# EAGLE design remote_connector (EAGLE 5.07)
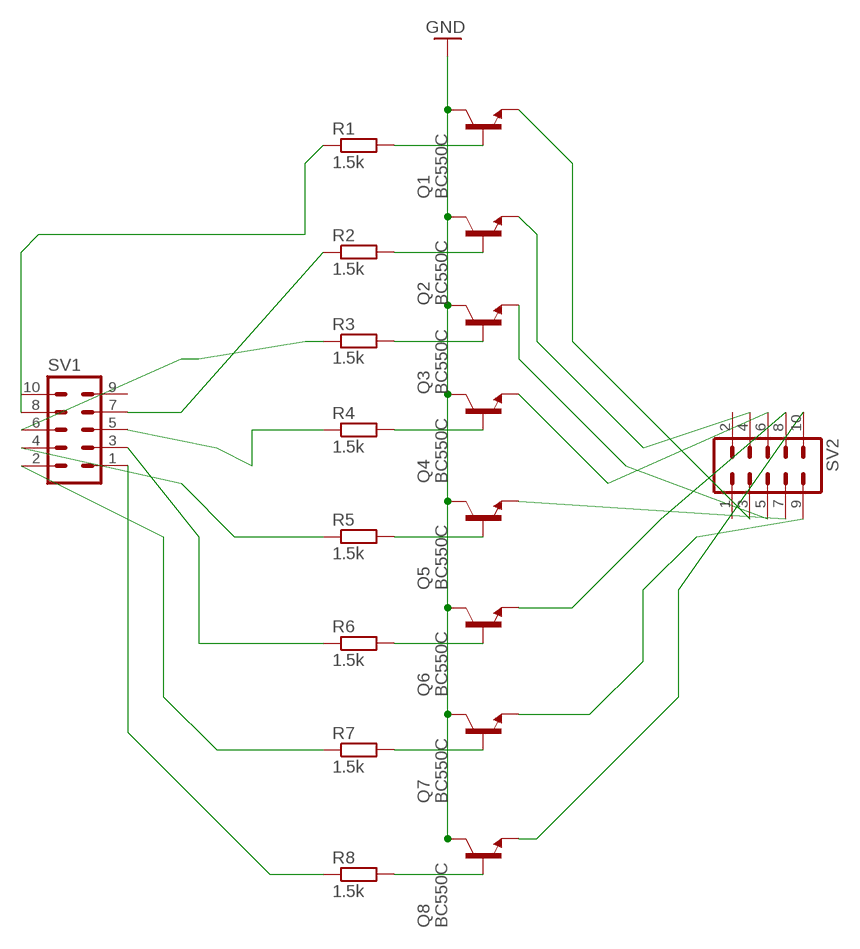
[diagram p0: schematic, sheet 1]

## Parts
Q1  BC550C  [TO92-EBC]
Q2  BC550C  [TO92-EBC]
Q3  BC550C  [TO92-EBC]
Q4  BC550C  [TO92-EBC]
Q5  BC550C  [TO92-EBC]
Q6  BC550C  [TO92-EBC]
Q7  BC550C  [TO92-EBC]
Q8  BC550C  [TO92-EBC]
R1  1.5k  R-EU_0204/7  [0204/7]
R2  1.5k  R-EU_0204/7  [0204/7]
R3  1.5k  R-EU_0204/7  [0204/7]
R4  1.5k  R-EU_0204/7  [0204/7]
R5  1.5k  R-EU_0204/7  [0204/7]
R6  1.5k  R-EU_0204/7  [0204/7]
R7  1.5k  R-EU_0204/7  [0204/7]
R8  1.5k  R-EU_0204/7  [0204/7]
SV1  MA05-2  [MA05-2]
SV2  MA05-2  [MA05-2]

## Nets
GND [gnd]: Q1.C Q2.C Q3.C Q4.C Q5.C Q6.C Q7.C Q8.C
N$1: R8.1 SV1.1
N$2: Q8.B R8.2
N$3: Q7.B R7.2
N$4: Q6.B R6.2
N$5: Q5.B R5.2
N$6: Q4.B R4.2
N$7: Q3.B R3.2
N$8: Q2.B R2.2
N$9: Q1.B R1.2
N$10: R7.1 SV1.2
N$11: R6.1 SV1.3
N$12: R5.1 SV1.4
N$13: R4.1 SV1.5
N$14: R3.1 SV1.6
N$15: R2.1 SV1.7
N$16: R1.1 SV1.8
N$17: Q8.E SV2.10
N$18: Q7.E SV2.9
N$19: Q6.E SV2.8
N$20: Q5.E SV2.7
N$21: Q4.E SV2.6
N$22: Q3.E SV2.5
N$23: Q2.E SV2.4
N$24: Q1.E SV2.3
Unconnected: SV1.9 SV1.10 SV2.1 SV2.2

## Library data of the parts
Q1-Q8 = transistor-npn:BC550*: NPN Transistor
R1-R8 = rcl:R-EU_: RESISTOR, European symbol
SV1 SV2 = con-lstb:MA05-2: PIN HEADER

## Board
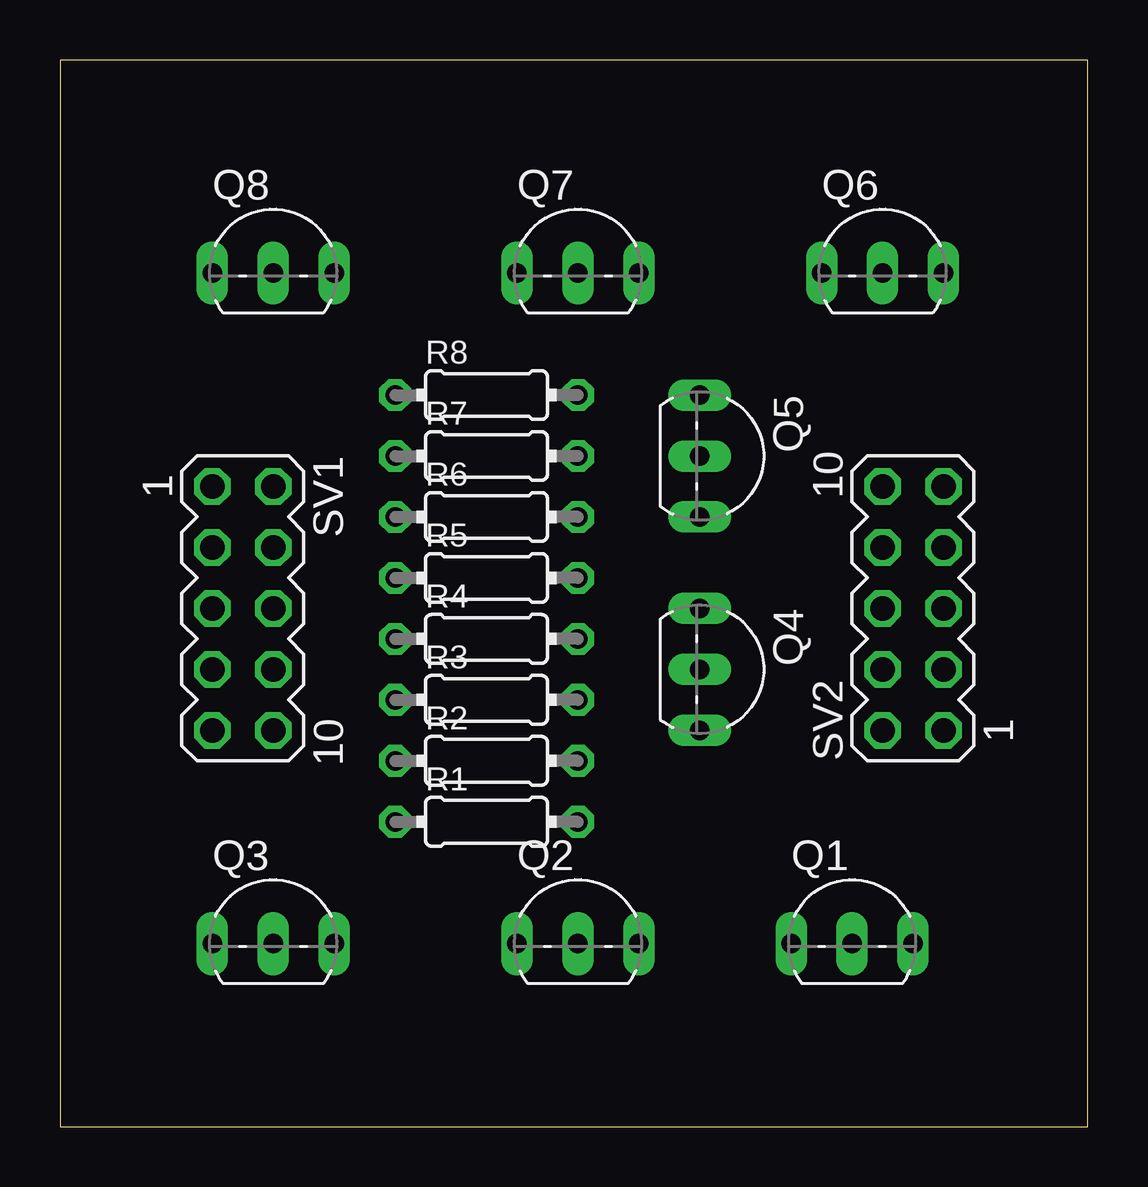
[diagram p1: board, top side]
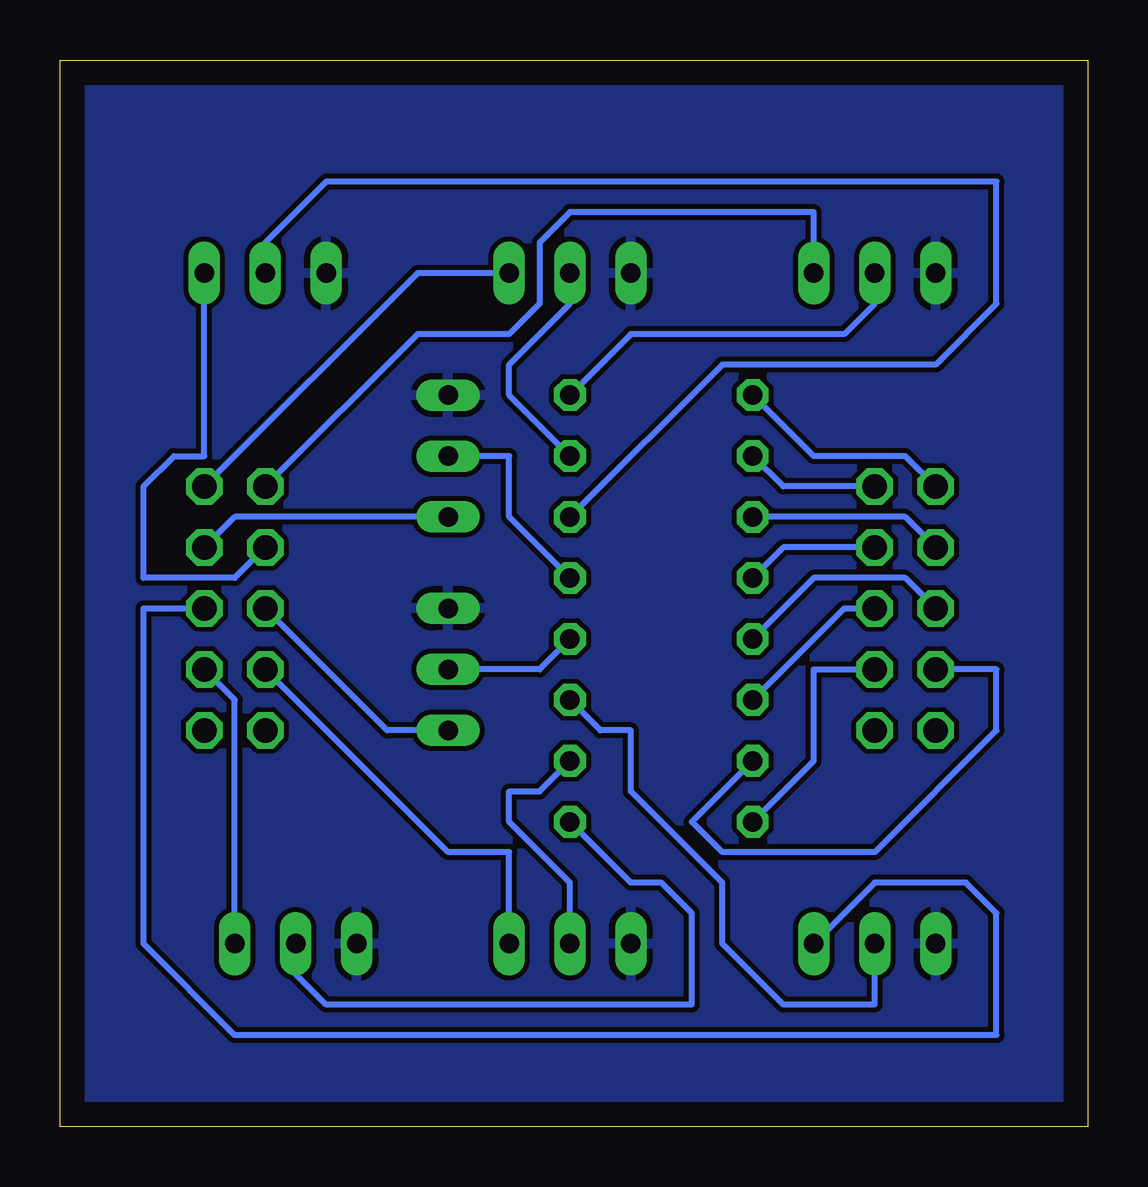
[diagram p2: board, bottom side, seen from below]

Size 42.85 x 44.44 mm. Coordinates in mm from the lower left corner, seen from the top.
Outline: 0,0 42.85,0 42.85,44.44 0,44.44 0,0
Copper layers (1*16): Top 0.035mm / dielectric 1.5mm / Bottom 0.035mm
Design rules "default": minimum track width 10mil, minimum drill 24mil, track to track 8mil, track to pad 8mil, pad to pad 8mil, via to via 8mil, smd to smd 8mil, copper to edge 40mil, drill to drill 8mil, minimum pad ring 10mil, minimum via ring 8mil, stop-mask expansion 4mil, vias tented up to drill 0mil, thermal gap 10mil

### Footprints (pad centres in the part's own frame; a part is rotated, then mirrored left to right if it is on the bottom)
TO92-EBC = drill 0.813 long: B 0,-1.27; C -2.54,-1.27; E 2.54,-1.27
0204/7 = drill 0.813 octagon: 1 -3.81,0; 2 3.81,0
MA05-2 = drill 1.016 octagon: 1 -5.08,-1.27; 2 -5.08,1.27; 3 -2.54,-1.27; 4 -2.54,1.27; 5 0,-1.27; 6 0,1.27; 7 2.54,-1.27; 8 2.54,1.27; 9 5.08,-1.27; 10 5.08,1.27

### Placement (x,y rotation side)
Q1  33.02,8.89 0 top
Q2  21.59,8.89 0 top
Q3  8.89,8.89 0 top
Q4  27.94,19.05 270 top
Q5  27.94,27.94 270 top
Q6  34.29,36.83 0 top
Q7  21.59,36.83 0 top
Q8  8.89,36.83 0 top
R1  17.78,12.7 0 top
R2  17.78,15.24 0 top
R3  17.78,17.78 0 top
R4  17.78,20.32 0 top
R5  17.78,22.86 0 top
R6  17.78,25.4 0 top
R7  17.78,27.94 0 top
R8  17.78,30.48 0 top
SV1  7.62,21.59 270 top
SV2  35.56,21.59 90 top

### Tracks (layer width: path | path; a pad name or v marks a point on that pad's centre or on a via)
GND
  pour Bottom: 0,0 43.18,0 43.18,44.45 0,44.45
N$1
  Bottom 0.254: R8.1 11.43,27.94 7.62,27.94 SV1.1
N$2
  Bottom 0.254: R8.2 19.05,33.02 10.16,33.02 8.89,34.29 Q8.B
N$3
  Bottom 0.254: R7.2 24.13,30.48 24.13,31.75 21.59,34.29 Q7.B
N$4
  Bottom 0.254: R6.2 15.24,31.75 6.35,31.75 3.81,34.29 3.81,39.37 31.75,39.37 34.29,36.83 Q6.B
N$5
  Bottom 0.254: R5.2 24.13,25.4 24.13,27.94 Q5.B
N$6
  Bottom 0.254: Q4.B 22.86,19.05 R4.2
N$7
  Bottom 0.254: Q3.B 8.89,5.08 12.7,5.08 15.24,7.62 15.24,10.16 19.05,13.97 19.05,16.51 20.32,16.51 R3.2
N$8
  Bottom 0.254: Q2.B 21.59,10.16 24.13,12.7 24.13,13.97 22.86,13.97 R2.2
N$9
  Bottom 0.254: R1.2 19.05,10.16 17.78,10.16 16.51,8.89 16.51,5.08 31.75,5.08 33.02,6.35 Q1.B
N$10
  Bottom 0.254: R7.1 12.7,26.67 SV1.2
N$11
  Bottom 0.254: R6.1 7.62,25.4 SV1.3
N$12
  Bottom 0.254: R5.1 12.7,24.13 SV1.4
N$13
  Bottom 0.254: R4.1 11.43,22.86 7.62,22.86 SV1.5
N$14
  Bottom 0.254: R3.1 10.16,21.59 SV1.6
N$15
  Bottom 0.254: R2.1 16.51,12.7 15.24,11.43 8.89,11.43 3.81,16.51 3.81,19.05 SV1.7
N$16
  Bottom 0.254: R1.1 11.43,15.24 11.43,19.05 SV1.8
N$17
  Bottom 0.254: Q8.E 11.43,38.1 21.59,38.1 22.86,36.83 22.86,34.29 24.13,33.02 27.94,33.02 SV2.10
N$18
  Bottom 0.254: Q7.E 27.94,35.56 SV2.9
N$19
  Bottom 0.254: Q6.E 36.83,27.94 38.1,27.94 39.37,26.67 39.37,22.86 35.56,22.86 SV2.8
N$20
  Bottom 0.254: Q5.E 35.56,25.4 SV2.7
N$21
  Bottom 0.254: Q4.E 29.21,16.51 SV2.6
N$22
  Bottom 0.254: Q3.E 8.89,10.16 5.08,10.16 3.81,8.89 3.81,3.81 35.56,3.81 39.37,7.62 39.37,21.59 SV2.5
N$23
  Bottom 0.254: Q2.E 24.13,11.43 26.67,11.43 SV2.4
N$24
  Bottom 0.254: Q1.E 35.56,17.78 SV2.3